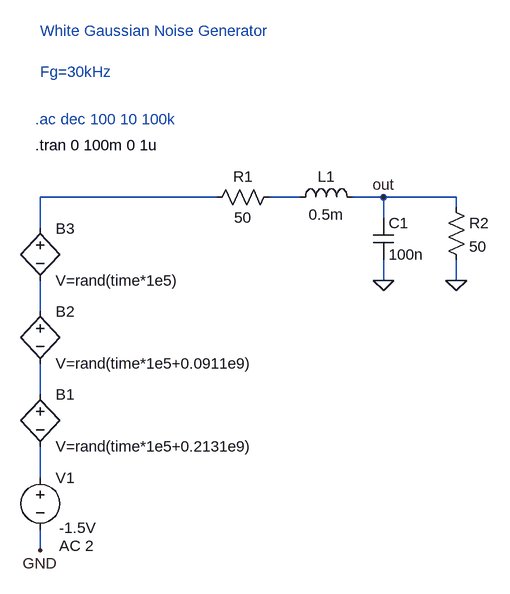
[diagram p0: schematic white_gauss1.asc]
white_gauss1.asc, the LTspice schematic file:
Version 4
SHEET 1 912 712
WIRE 192 80 192 32
WIRE 192 -96 192 -48
WIRE 192 -176 192 -224
WIRE 192 -224 464 -224
WIRE 544 -224 592 -224
WIRE 720 -224 720 -192
WIRE 720 -128 720 -96
WIRE 672 -224 720 -224
WIRE 720 -224 832 -224
WIRE 832 -224 832 -208
WIRE 832 -128 832 -96
WIRE 192 208 192 160
WIRE 192 288 192 320
FLAG 192 320 GND
FLAG 720 -96 0
FLAG 720 -224 out
FLAG 832 -96 0
SYMBOL BV 192 64 R0
SYMATTR InstName B1
SYMATTR Value V=rand(time*1e5+0.2131e9)
SYMBOL bv 192 -64 R0
SYMATTR InstName B2
SYMATTR Value V=rand(time*1e5+0.0911e9)
SYMBOL bv 192 -192 R0
SYMATTR InstName B3
SYMATTR Value V=rand(time*1e5)
SYMBOL res 448 -208 R270
WINDOW 0 32 56 VTop 0
WINDOW 3 0 56 VBottom 0
SYMATTR InstName R1
SYMATTR Value 50
SYMBOL cap 704 -192 R0
SYMATTR InstName C1
SYMATTR Value 100n
SYMBOL ind 576 -208 R270
WINDOW 0 32 56 VTop 0
WINDOW 3 5 56 VBottom 0
SYMATTR InstName L1
SYMATTR Value 0.5m
SYMBOL res 816 -224 R0
SYMATTR InstName R2
SYMATTR Value 50
SYMBOL voltage 192 192 R0
WINDOW 3 29 93 Left 0
WINDOW 123 29 121 Left 0
WINDOW 39 0 0 Left 0
SYMATTR InstName V1
SYMATTR Value -1.5V
SYMATTR Value2 AC 2
TEXT 184 -304 Left 0 !.tran 0 100m 0 1u
TEXT 184 -344 Left 0 ;.ac dec 100 10 100k
TEXT 192 -480 Left 0 ;White Gaussian Noise Generator\n \nFg=30kHz

The netlist it stands for:
* white_gauss1.asc
B1 N001 N005 V=rand(time*1e5+0.2131e9)
B2 N002 N001 V=rand(time*1e5+0.0911e9)
B3 N003 N002 V=rand(time*1e5)
R1 N003 N004 50
C1 out 0 100n
L1 N004 out 0.5m
R2 out 0 50
V1 N005 GND -1.5V AC 2
.tran 0 100m 0 1u
* .ac dec 100 10 100k
* White Gaussian Noise Generator
* Fg=30kHz
.backanno
.end